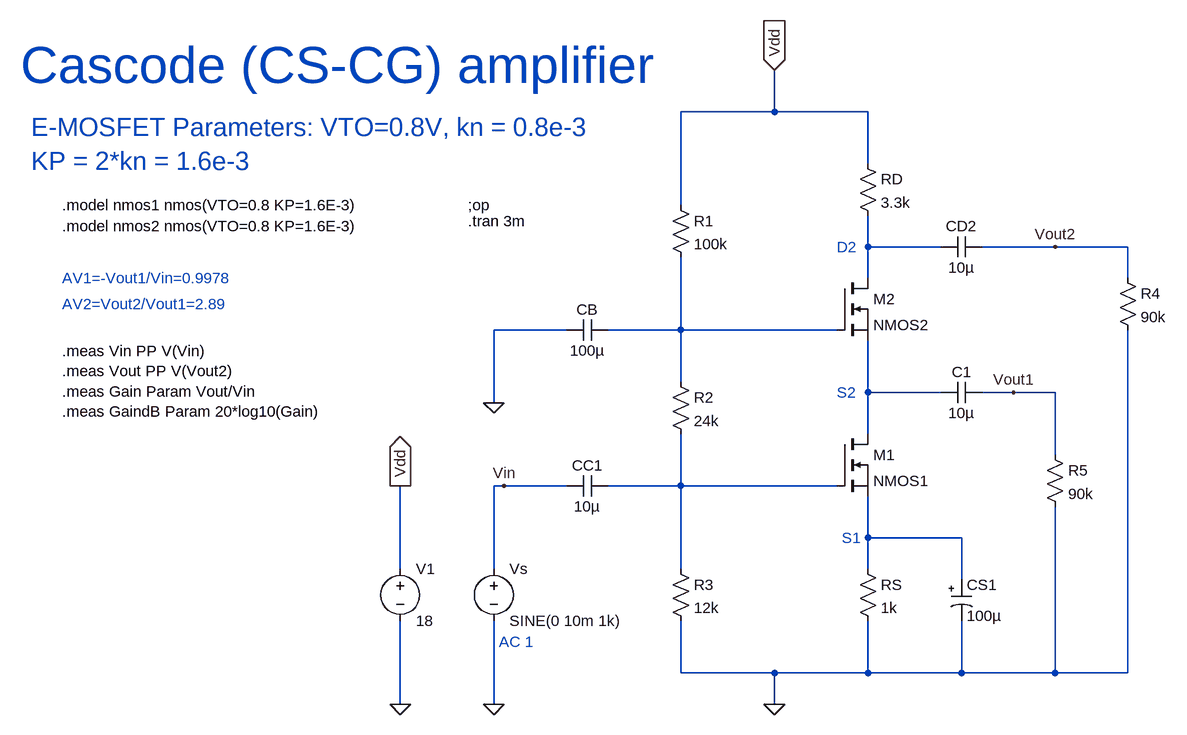
[diagram p0: schematic Cascode (CS-CG) amplifier.asc]
Cascode (CS-CG) amplifier.asc, the LTspice schematic file:
Version 4
SHEET 1 1160 776
WIRE 288 -288 288 -352
WIRE 288 -288 144 -288
WIRE 432 -288 288 -288
WIRE 432 -208 432 -288
WIRE 144 -144 144 -288
WIRE 432 -80 432 -128
WIRE 544 -80 432 -80
WIRE 720 -80 608 -80
WIRE 832 -80 720 -80
WIRE 432 -32 432 -80
WIRE 832 -32 832 -80
WIRE -32 48 -144 48
WIRE 144 48 144 -64
WIRE 144 48 32 48
WIRE 384 48 144 48
WIRE 144 128 144 48
WIRE 432 144 432 64
WIRE 544 144 432 144
WIRE 656 144 608 144
WIRE 720 144 656 144
WIRE -144 160 -144 48
WIRE 432 208 432 144
WIRE 720 240 720 144
WIRE -128 288 -144 288
WIRE -32 288 -128 288
WIRE 144 288 144 208
WIRE 144 288 32 288
WIRE 384 288 144 288
WIRE 432 368 432 304
WIRE 576 368 432 368
WIRE -288 416 -288 288
WIRE -144 416 -144 288
WIRE 144 416 144 288
WIRE 432 416 432 368
WIRE 576 432 576 368
WIRE 144 576 144 496
WIRE 288 576 144 576
WIRE 432 576 432 496
WIRE 432 576 288 576
WIRE 576 576 576 496
WIRE 576 576 432 576
WIRE 720 576 720 320
WIRE 720 576 576 576
WIRE 832 576 832 48
WIRE 832 576 720 576
WIRE -288 624 -288 496
WIRE -144 624 -144 496
WIRE 288 624 288 576
FLAG 288 624 0
FLAG -144 624 0
FLAG -288 624 0
FLAG -144 160 0
FLAG -288 288 Vdd
IOPIN -288 288 Out
FLAG 288 -352 Vdd
IOPIN 288 -352 In
FLAG 720 -80 Vout2
FLAG 656 144 Vout1
FLAG -128 288 Vin
SYMBOL nmos 384 208 R0
SYMATTR InstName M1
SYMATTR Value NMOS1
SYMBOL nmos 384 -32 R0
SYMATTR InstName M2
SYMATTR Value NMOS2
SYMBOL res 128 -160 R0
SYMATTR InstName R1
SYMATTR Value 100k
SYMBOL res 128 112 R0
SYMATTR InstName R2
SYMATTR Value 24k
SYMBOL res 128 400 R0
SYMATTR InstName R3
SYMATTR Value 12k
SYMBOL res 416 -224 R0
SYMATTR InstName RD
SYMATTR Value 3.3k
SYMBOL res 416 400 R0
SYMATTR InstName RS
SYMATTR Value 1k
SYMBOL cap 608 128 R90
WINDOW 0 0 32 VBottom 2
WINDOW 3 32 32 VTop 2
SYMATTR InstName C1
SYMATTR Value 10µ
SYMBOL cap 608 -96 R90
WINDOW 0 0 32 VBottom 2
WINDOW 3 32 32 VTop 2
SYMATTR InstName CD2
SYMATTR Value 10µ
SYMBOL cap 32 272 R90
WINDOW 0 0 32 VBottom 2
WINDOW 3 32 32 VTop 2
SYMATTR InstName CC1
SYMATTR Value 10µ
SYMBOL cap 32 32 R90
WINDOW 0 0 32 VBottom 2
WINDOW 3 32 32 VTop 2
SYMATTR InstName CB
SYMATTR Value 100µ
SYMBOL voltage -144 400 R0
WINDOW 123 0 0 Left 0
WINDOW 39 0 0 Left 0
SYMATTR InstName Vs
SYMATTR Value SINE(0 10m 1k)
SYMBOL voltage -288 400 R0
WINDOW 123 0 0 Left 0
WINDOW 39 0 0 Left 0
SYMATTR InstName V1
SYMATTR Value 18
SYMBOL polcap 560 432 R0
SYMATTR InstName CS1
SYMATTR Value 100µ
SYMBOL res 816 -48 R0
SYMATTR InstName R4
SYMATTR Value 90k
SYMBOL res 704 224 R0
SYMATTR InstName R5
SYMATTR Value 90k
TEXT -808 -144 Left 2 !.model nmos1 nmos(VTO=0.8 KP=1.6E-3)
TEXT 384 -80 Left 2 ;D2
TEXT 384 144 Left 2 ;S2
TEXT 392 368 Left 2 ;S1
TEXT -872 -360 Left 6 ;Cascode (CS-CG) amplifier
TEXT -856 -264 Left 4 ;E-MOSFET Parameters: VTO=0.8V, kn = 0.8e-3\nKP = 2*kn = 1.6e-3
TEXT -184 -120 Left 2 !.tran 3m
TEXT -808 -112 Left 2 !.model nmos2 nmos(VTO=0.8 KP=1.6E-3)
TEXT -136 528 Left 2 ;AC 1
TEXT -808 80 Left 2 !.meas Vin PP V(Vin)\n.meas Vout PP V(Vout2)\n.meas Gain Param Vout/Vin\n.meas GaindB Param 20*log10(Gain)
TEXT -808 -32 Left 2 ;AV1=-Vout1/Vin=0.9978
TEXT -808 8 Left 2 ;AV2=Vout2/Vout1=2.89
TEXT -184 -144 Left 2 !;op

The netlist it stands for:
* Cascode (CS-CG) amplifier.asc
M1 N003 N004 N005 N005 NMOS1
M2 N001 N002 N003 N003 NMOS2
R1 Vdd N002 100k
R2 N002 N004 24k
R3 N004 0 12k
RD Vdd N001 3.3k
RS N005 0 1k
C1 Vout1 N003 10µ
CD2 Vout2 N001 10µ
CC1 N004 Vin 10µ
CB N002 0 100µ
Vs Vin 0 SINE(0 10m 1k)
V1 Vdd 0 18
CS1 N005 0 100µ
R4 Vout2 0 90k
R5 Vout1 0 90k
.model NMOS NMOS
.model PMOS PMOS
.lib standard.mos
.model nmos1 nmos(VTO=0.8 KP=1.6E-3)
* D2
* S2
* S1
* Cascode (CS-CG) amplifier
* E-MOSFET Parameters: VTO=0.8V, kn = 0.8e-3
* KP = 2*kn = 1.6e-3
.tran 3m
.model nmos2 nmos(VTO=0.8 KP=1.6E-3)
* AC 1
.meas Vin PP V(Vin)
.meas Vout PP V(Vout2)
.meas Gain Param Vout/Vin
.meas GaindB Param 20*log10(Gain)
* AV1=-Vout1/Vin=0.9978
* AV2=Vout2/Vout1=2.89
;op
.backanno
.end